# EasyEDA schematic EasyEDA-schematic-flat-version.json
TITLE: RFID password generator - flat version; REV: 1.0; Date: 2017-09-15; Sheet: 1/1; Drawn By: Julian Schuler
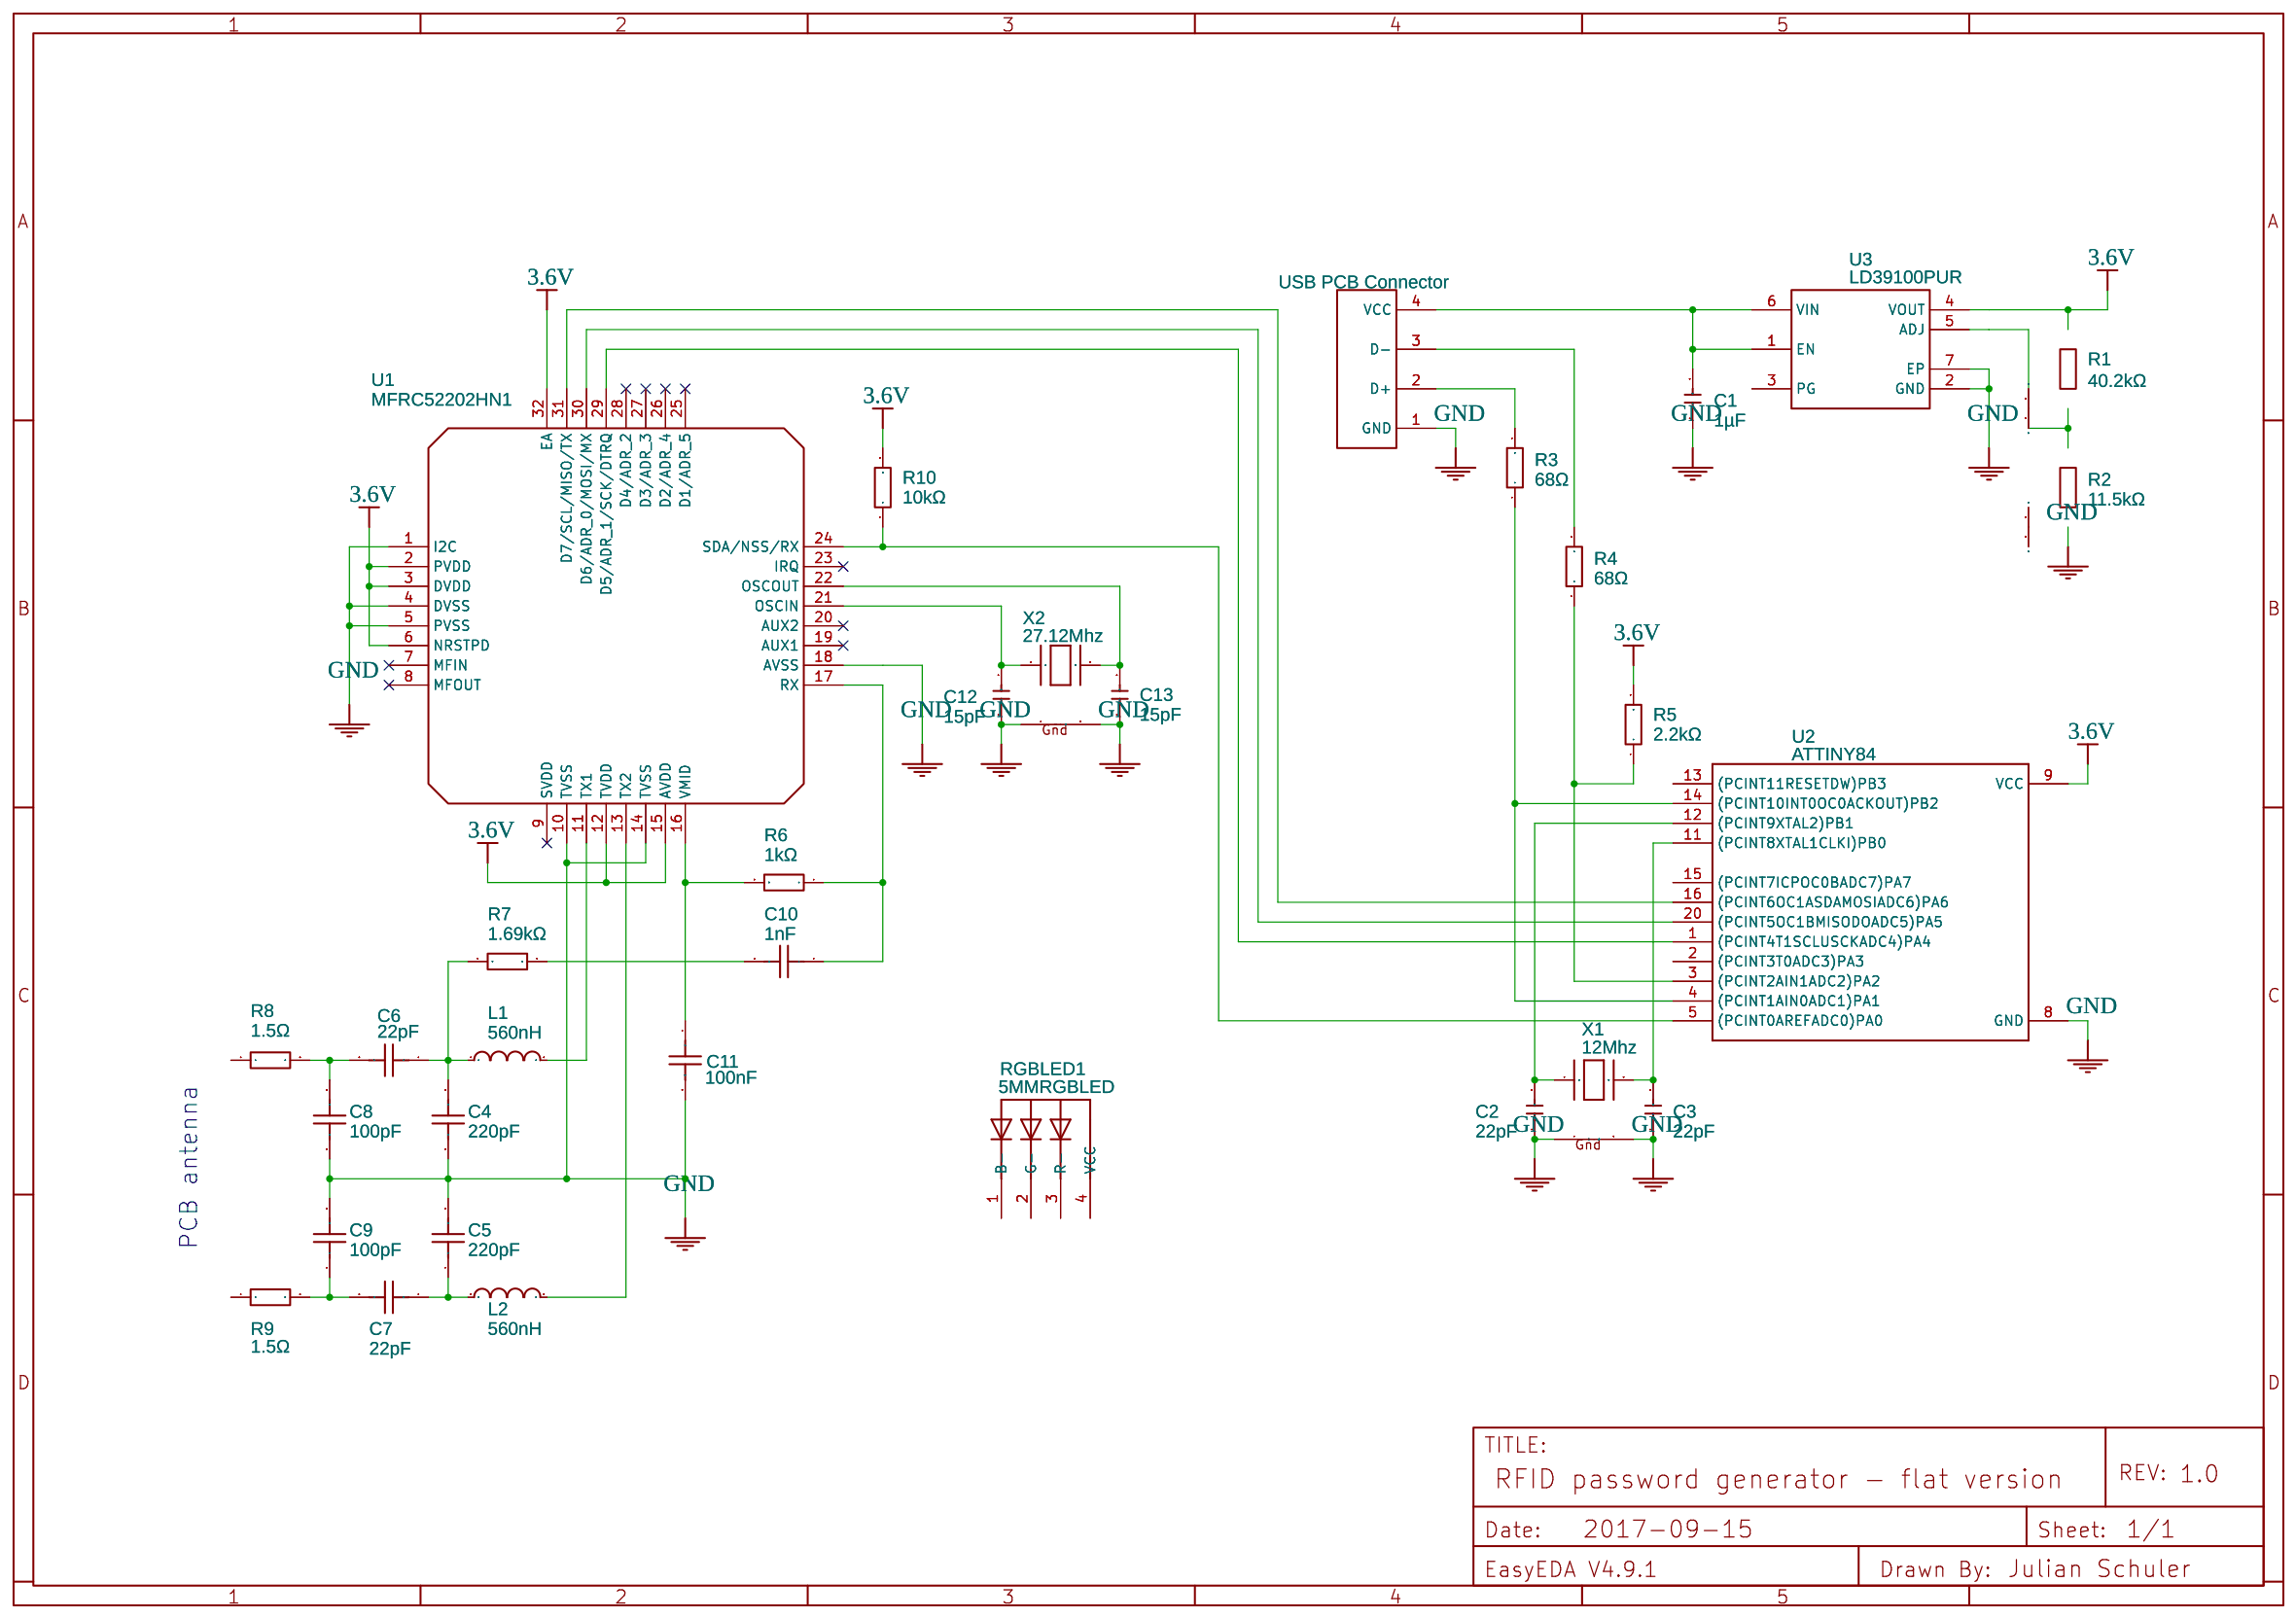
[diagram p0: schematic sheet]

## Parts
C1  1µF  [R0603]
C2  22pF  [R0603]
C3  22pF  [R0603]
C4  220pF  [R0603]
C5  220pF  [R0603]
C6  22pF  [R0603]
C7  22pF  [R0603]
C8  100pF  [R0603]
C9  100pF  [R0603]
C10  1nF  [R0603]
C11  100nF  [R0603]
C12  15pF  [R0603]
C13  15pF  [R0603]
L1  560nH  [R0603]
L2  560nH  [R0603]
R1  40.2kΩ  [R0603]
R2  11.5kΩ  [R0603]
R3  68Ω  [R0603]
R4  68Ω  [R0603]
R5  2.2kΩ  [R0603]
R6  1kΩ  [R0603]
R7  1.69kΩ  [R0603]
R8  1.5Ω  [R0603]
R9  1.5Ω  [R0603]
R10  10kΩ  [R0603]
RGBLED1  5MMRGBLED  [5MM RGB LED - COMMON CATHODE]
U1  MFRC52202HN1  [QFN-32_5X5X05P]
U2  ATTINY84  [QFN20]
U3  LD39100PUR  [DFN6D]
U4  USB PCB Connector  [USB PCB CONNECTOR]
X1  12Mhz  [OSC-YSX-3225_4P]
X2  27.12Mhz  [HCR2016]

## Library data of the parts
C1-C3 U3 = -: catid: 20
C4-C11 = Capacitor
C12 C13 = -: catid: 20; Capacity: 22pF
L1 L2 = Inductor
R1 R2 = Resistor: Tolerance: ±1%
R3-R10 = -: Tolerance: ±1%
RGBLED1 = -: catid: 20; Contributor: Adafruit; Manufacturer Part: ?
U1 = -: Supplier: LCSC; Manufacturer: NXP; LCSC: C11322
U2 = -: catid: 20; Contributor: SparkFun; Manufacturer Part: ?
U4 = -: Mounted: No
X1 = -: catid: 20; Frequncy: 12MHz
X2 = -: catid: 20; Frequncy: 27.12MHz

## Nets
3.6V: R1.2 R5.2 R10.2 U1.2(PVDD) U1.3(DVDD) U1.6(NRSTPD) U1.12(TVDD) U1.15(AVDD) U1.32(EA) U2.9(VCC) U3.4(VOUT)
GND: C1.1 C2.1 C3.1 C4.1 C5.2 C8.1 C9.2 C11.2 C12.1 C13.1 R2.1 U1.1(I2C) U1.4(DVSS) U1.5(PVSS) U1.10(TVSS) U1.14(TVSS) U1.18(AVSS) U2.8(GND) U3.2(GND) U3.7(EP) U4.1(GND) X1.2(GND2) X1.4(GND1) X2.2(G2) X2.4(G1)
Net-(C1-2): C1.2 U3.1(EN) U3.6(VIN) U4.4(VCC)
Net-(C2-2): C2.2 U2.12((PCINT9XTAL2)PB1) X1.1(X1)
Net-(C3-2): C3.2 U2.11((PCINT8XTAL1CLKI)PB0) X1.3(X2)
Net-(C4-2): C4.2 C6.1 L1.1 R7.2
Net-(C5-1): C5.1 C7.1 L2.1
Net-(C6-2): C6.2 C8.2 R8.2
Net-(C7-2): C7.2 C9.1 R9.2
Net-(C10-1): C10.1 R6.1 U1.17(RX)
Net-(C10-2): C10.2 R7.1
Net-(C11-1): C11.1 R6.2 U1.16(VMID)
Net-(C12-2): C12.2 U1.21(OSCIN) X2.1(X1)
Net-(C13-2): C13.2 U1.22(OSCOUT) X2.3(X2)
Net-(L1-2): L1.2 U1.11(TX1)
Net-(L2-2): L2.2 U1.13(TX2)
Net-(R1-1): R1.1 R2.2 U3.5(ADJ)
Net-(R3-1): R3.1 U2.4((PCINT1AIN0ADC1)PA1) U2.14((PCINT10INT0OC0ACKOUT)PB2)
Net-(R3-2): R3.2 U4.2(D+)
Net-(R4-1): R4.1 R5.1 U2.3((PCINT2AIN1ADC2)PA2)
Net-(R4-2): R4.2 U4.3(D-)
Net-(R10-1): R10.1 U1.24(SDA/NSS/RX) U2.5((PCINT0AREFADC0)PA0)
Net-(U1-29): U1.29(D5/ADR_1/SCK/DTRQ) U2.1((PCINT4T1SCLUSCKADC4)PA4)
Net-(U1-30): U1.30(D6/ADR_0/MOSI/MX) U2.20((PCINT5OC1BMISODOADC5)PA5)
Net-(U1-31): U1.31(D7/SCL/MISO/TX) U2.16((PCINT6OC1ASDAMOSIADC6)PA6)

Not connected (* = marked no-connect by the designer): R8 1; R9 1; RGBLED1 1(B-) 2(G-) 3(R-) 4(VCC); U1 7(MFIN)* 8(MFOUT)* 9(SVDD)* 19(AUX1)* 20(AUX2)* 23(IRQ)* 25(D1/ADR_5)* 26(D2/ADR_4)* 27(D3/ADR_3)* 28(D4/ADR_2)*; U2 2((PCINT3T0ADC3)PA3) 13((PCINT11RESETDW)PB3) 15((PCINT7ICPOC0BADC7)PA7); U3 3(PG)

## Notes on the sheet
- PCB antenna
